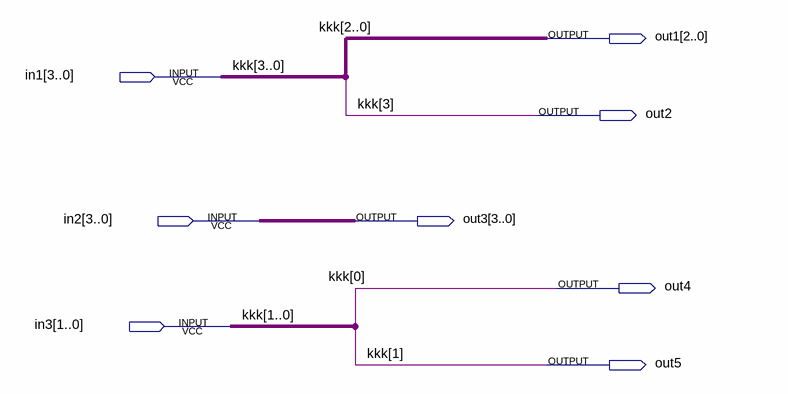
[diagram p0: schematic sheet]
// Quartus schematic check_data_split.bdf as structural Verilog: 0 symbols, 8 pins
module check_data_split (
  input  [3:0] in1,
  input  [3:0] in2,
  input  [1:0] in3,
  output [2:0] out1,
  output out2,
  output [3:0] out3,
  output out4,
  output out5
);


  assign in3 = in1[1:0];
  assign out1 = in1[2:0];
  assign out2 = in1[3];
  assign out3 = in2;
  assign out4 = in1[0];
  assign out5 = in1[1];

  // Other names for the same wires on the sheet: kkk[3:0] = in1
endmodule
